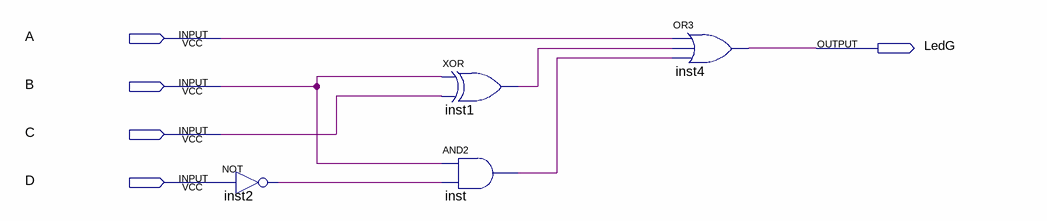
[diagram p0: schematic sheet]
// Quartus schematic LEDbcdG.bdf as structural Verilog: 4 symbols, 5 pins
module LEDbcdG (
  input  A,
  input  B,
  input  C,
  input  D,
  output LedG
);

  wire inst1_out, inst2_out, inst_out;

  not inst2 (inst2_out, D);
  xor inst1 (inst1_out, B, C);
  and inst (inst_out, B, inst2_out);
  or inst4 (LedG, A, inst1_out, inst_out);
endmodule
